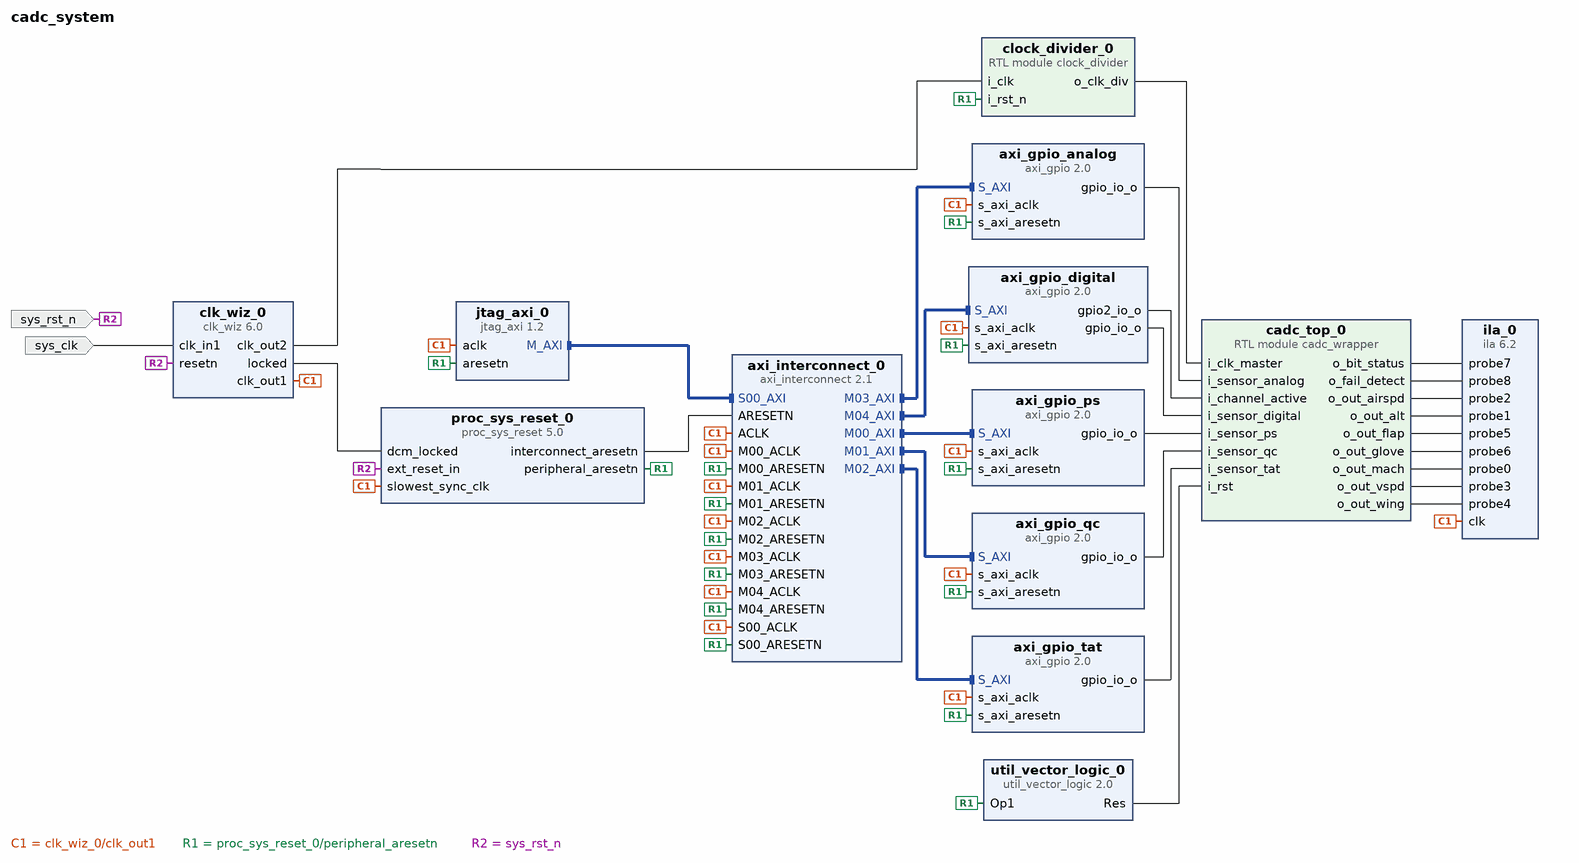
[diagram p0: block diagram of the top level]
# Vivado block design cadc_system, xc7a35tcpg236-1, Vivado 2025.1
create_bd_design cadc_system

create_bd_port -dir I -type clk sys_clk
set_property -dict {CONFIG.FREQ_HZ 12000000} [get_bd_ports sys_clk]
create_bd_port -dir I -type rst sys_rst_n
set_property -dict {CONFIG.POLARITY ACTIVE_LOW} [get_bd_ports sys_rst_n]

create_bd_cell -type ip -vlnv xilinx.com:ip:clk_wiz:6.0 clk_wiz_0
set_property -dict [list \
  CONFIG.CLKOUT1_REQUESTED_OUT_FREQ 100.000 \
  CONFIG.CLKOUT2_REQUESTED_OUT_FREQ 6.000 \
  CONFIG.CLKOUT2_USED true \
  CONFIG.PRIM_IN_FREQ 12.000 \
  CONFIG.RESET_TYPE ACTIVE_LOW \
  CONFIG.USE_LOCKED true \
  CONFIG.USE_RESET true \
] [get_bd_cells clk_wiz_0]
create_bd_cell -type ip -vlnv xilinx.com:ip:proc_sys_reset:5.0 proc_sys_reset_0
create_bd_cell -type ip -vlnv xilinx.com:ip:jtag_axi:1.2 jtag_axi_0
set_property -dict {CONFIG.PROTOCOL 2} [get_bd_cells jtag_axi_0]
create_bd_cell -type ip -vlnv xilinx.com:ip:axi_interconnect:2.1 axi_interconnect_0
set_property -dict {CONFIG.NUM_MI 5 CONFIG.NUM_SI 1} [get_bd_cells axi_interconnect_0]
create_bd_cell -type ip -vlnv xilinx.com:ip:axi_gpio:2.0 axi_gpio_ps
set_property -dict {CONFIG.C_ALL_OUTPUTS 1 CONFIG.C_DOUT_DEFAULT 0x00000000 CONFIG.C_GPIO_WIDTH 20} [get_bd_cells axi_gpio_ps]
create_bd_cell -type ip -vlnv xilinx.com:ip:axi_gpio:2.0 axi_gpio_qc
set_property -dict {CONFIG.C_ALL_OUTPUTS 1 CONFIG.C_DOUT_DEFAULT 0x00000000 CONFIG.C_GPIO_WIDTH 20} [get_bd_cells axi_gpio_qc]
create_bd_cell -type ip -vlnv xilinx.com:ip:axi_gpio:2.0 axi_gpio_tat
set_property -dict {CONFIG.C_ALL_OUTPUTS 1 CONFIG.C_DOUT_DEFAULT 0x00000000 CONFIG.C_GPIO_WIDTH 20} [get_bd_cells axi_gpio_tat]
create_bd_cell -type ip -vlnv xilinx.com:ip:axi_gpio:2.0 axi_gpio_analog
set_property -dict {CONFIG.C_ALL_OUTPUTS 1 CONFIG.C_DOUT_DEFAULT 0x00000000 CONFIG.C_GPIO_WIDTH 20} [get_bd_cells axi_gpio_analog]
create_bd_cell -type ip -vlnv xilinx.com:ip:axi_gpio:2.0 axi_gpio_digital
set_property -dict [list \
  CONFIG.C_ALL_OUTPUTS 1 \
  CONFIG.C_ALL_OUTPUTS_2 1 \
  CONFIG.C_DOUT_DEFAULT 0x00000000 \
  CONFIG.C_DOUT_DEFAULT_2 0x00000001 \
  CONFIG.C_GPIO2_WIDTH 1 \
  CONFIG.C_GPIO_WIDTH 20 \
  CONFIG.C_IS_DUAL 1 \
] [get_bd_cells axi_gpio_digital]
create_bd_cell -type module -reference clock_divider clock_divider_0
create_bd_cell -type module -reference cadc_wrapper cadc_top_0
create_bd_cell -type ip -vlnv xilinx.com:ip:ila:6.2 ila_0
set_property -dict [list \
  CONFIG.C_DATA_DEPTH 4096 \
  CONFIG.C_EN_STRG_QUAL 1 \
  CONFIG.C_NUM_OF_PROBES 9 \
  CONFIG.C_PROBE0_WIDTH 20 \
  CONFIG.C_PROBE1_WIDTH 20 \
  CONFIG.C_PROBE2_WIDTH 20 \
  CONFIG.C_PROBE3_WIDTH 20 \
  CONFIG.C_PROBE4_WIDTH 20 \
  CONFIG.C_PROBE5_WIDTH 20 \
  CONFIG.C_PROBE6_WIDTH 20 \
  CONFIG.C_PROBE7_WIDTH 1 \
  CONFIG.C_PROBE8_WIDTH 1 \
  CONFIG.C_TRIGIN_EN false \
  CONFIG.C_TRIGOUT_EN false \
] [get_bd_cells ila_0]
create_bd_cell -type ip -vlnv xilinx.com:ip:util_vector_logic:2.0 util_vector_logic_0
set_property -dict {CONFIG.C_OPERATION not CONFIG.C_SIZE 1} [get_bd_cells util_vector_logic_0]

# ---- connections ----

connect_bd_intf_net [get_bd_intf_pins axi_interconnect_0/M00_AXI] [get_bd_intf_pins axi_gpio_ps/S_AXI]
connect_bd_intf_net [get_bd_intf_pins axi_interconnect_0/M01_AXI] [get_bd_intf_pins axi_gpio_qc/S_AXI]
connect_bd_intf_net [get_bd_intf_pins axi_interconnect_0/M02_AXI] [get_bd_intf_pins axi_gpio_tat/S_AXI]
connect_bd_intf_net [get_bd_intf_pins axi_interconnect_0/M03_AXI] [get_bd_intf_pins axi_gpio_analog/S_AXI]
connect_bd_intf_net [get_bd_intf_pins axi_interconnect_0/M04_AXI] [get_bd_intf_pins axi_gpio_digital/S_AXI]
connect_bd_intf_net [get_bd_intf_pins jtag_axi_0/M_AXI] [get_bd_intf_pins axi_interconnect_0/S00_AXI]
connect_bd_net [get_bd_pins axi_gpio_analog/gpio_io_o] [get_bd_pins cadc_top_0/i_sensor_analog]
connect_bd_net [get_bd_pins axi_gpio_digital/gpio2_io_o] [get_bd_pins cadc_top_0/i_channel_active]
connect_bd_net [get_bd_pins axi_gpio_digital/gpio_io_o] [get_bd_pins cadc_top_0/i_sensor_digital]
connect_bd_net [get_bd_pins axi_gpio_ps/gpio_io_o] [get_bd_pins cadc_top_0/i_sensor_ps]
connect_bd_net [get_bd_pins axi_gpio_qc/gpio_io_o] [get_bd_pins cadc_top_0/i_sensor_qc]
connect_bd_net [get_bd_pins axi_gpio_tat/gpio_io_o] [get_bd_pins cadc_top_0/i_sensor_tat]
connect_bd_net [get_bd_pins cadc_top_0/o_bit_status] [get_bd_pins ila_0/probe7]
connect_bd_net [get_bd_pins cadc_top_0/o_fail_detect] [get_bd_pins ila_0/probe8]
connect_bd_net [get_bd_pins cadc_top_0/o_out_airspd] [get_bd_pins ila_0/probe2]
connect_bd_net [get_bd_pins cadc_top_0/o_out_alt] [get_bd_pins ila_0/probe1]
connect_bd_net [get_bd_pins cadc_top_0/o_out_flap] [get_bd_pins ila_0/probe5]
connect_bd_net [get_bd_pins cadc_top_0/o_out_glove] [get_bd_pins ila_0/probe6]
connect_bd_net [get_bd_pins cadc_top_0/o_out_mach] [get_bd_pins ila_0/probe0]
connect_bd_net [get_bd_pins cadc_top_0/o_out_vspd] [get_bd_pins ila_0/probe3]
connect_bd_net [get_bd_pins cadc_top_0/o_out_wing] [get_bd_pins ila_0/probe4]
connect_bd_net [get_bd_pins clk_wiz_0/clk_out1] \
  [get_bd_pins proc_sys_reset_0/slowest_sync_clk] [get_bd_pins jtag_axi_0/aclk] [get_bd_pins axi_interconnect_0/ACLK] \
  [get_bd_pins axi_interconnect_0/S00_ACLK] [get_bd_pins axi_interconnect_0/M00_ACLK] \
  [get_bd_pins axi_interconnect_0/M01_ACLK] [get_bd_pins axi_interconnect_0/M02_ACLK] \
  [get_bd_pins axi_interconnect_0/M03_ACLK] [get_bd_pins axi_interconnect_0/M04_ACLK] [get_bd_pins axi_gpio_ps/s_axi_aclk] \
  [get_bd_pins axi_gpio_qc/s_axi_aclk] [get_bd_pins axi_gpio_tat/s_axi_aclk] [get_bd_pins axi_gpio_analog/s_axi_aclk] \
  [get_bd_pins axi_gpio_digital/s_axi_aclk] [get_bd_pins ila_0/clk]
connect_bd_net [get_bd_pins clk_wiz_0/clk_out2] [get_bd_pins clock_divider_0/i_clk]
connect_bd_net [get_bd_pins clk_wiz_0/locked] [get_bd_pins proc_sys_reset_0/dcm_locked]
connect_bd_net [get_bd_pins clock_divider_0/o_clk_div] [get_bd_pins cadc_top_0/i_clk_master]
connect_bd_net [get_bd_pins proc_sys_reset_0/interconnect_aresetn] [get_bd_pins axi_interconnect_0/ARESETN]
connect_bd_net [get_bd_pins proc_sys_reset_0/peripheral_aresetn] \
  [get_bd_pins clock_divider_0/i_rst_n] [get_bd_pins jtag_axi_0/aresetn] [get_bd_pins axi_interconnect_0/S00_ARESETN] \
  [get_bd_pins axi_interconnect_0/M00_ARESETN] [get_bd_pins axi_interconnect_0/M01_ARESETN] \
  [get_bd_pins axi_interconnect_0/M02_ARESETN] [get_bd_pins axi_interconnect_0/M03_ARESETN] \
  [get_bd_pins axi_interconnect_0/M04_ARESETN] [get_bd_pins axi_gpio_ps/s_axi_aresetn] \
  [get_bd_pins axi_gpio_qc/s_axi_aresetn] [get_bd_pins axi_gpio_tat/s_axi_aresetn] \
  [get_bd_pins axi_gpio_analog/s_axi_aresetn] [get_bd_pins axi_gpio_digital/s_axi_aresetn] \
  [get_bd_pins util_vector_logic_0/Op1]
connect_bd_net [get_bd_ports sys_clk] [get_bd_pins clk_wiz_0/clk_in1]
connect_bd_net [get_bd_ports sys_rst_n] [get_bd_pins clk_wiz_0/resetn] [get_bd_pins proc_sys_reset_0/ext_reset_in]
connect_bd_net [get_bd_pins util_vector_logic_0/Res] [get_bd_pins cadc_top_0/i_rst]

# ---- address map ----
assign_bd_address -offset 0x40000000 -range 64K -target_address_space [get_bd_addr_spaces jtag_axi_0/Data] [get_bd_addr_segs axi_gpio_ps/S_AXI/Reg]
assign_bd_address -offset 0x40010000 -range 64K -target_address_space [get_bd_addr_spaces jtag_axi_0/Data] [get_bd_addr_segs axi_gpio_qc/S_AXI/Reg]
assign_bd_address -offset 0x40020000 -range 64K -target_address_space [get_bd_addr_spaces jtag_axi_0/Data] [get_bd_addr_segs axi_gpio_tat/S_AXI/Reg]
assign_bd_address -offset 0x40030000 -range 64K -target_address_space [get_bd_addr_spaces jtag_axi_0/Data] [get_bd_addr_segs axi_gpio_analog/S_AXI/Reg]
assign_bd_address -offset 0x40040000 -range 64K -target_address_space [get_bd_addr_spaces jtag_axi_0/Data] [get_bd_addr_segs axi_gpio_digital/S_AXI/Reg]

validate_bd_design
save_bd_design
